# EAGLE schematic PinBed (EAGLE 6.5.0)
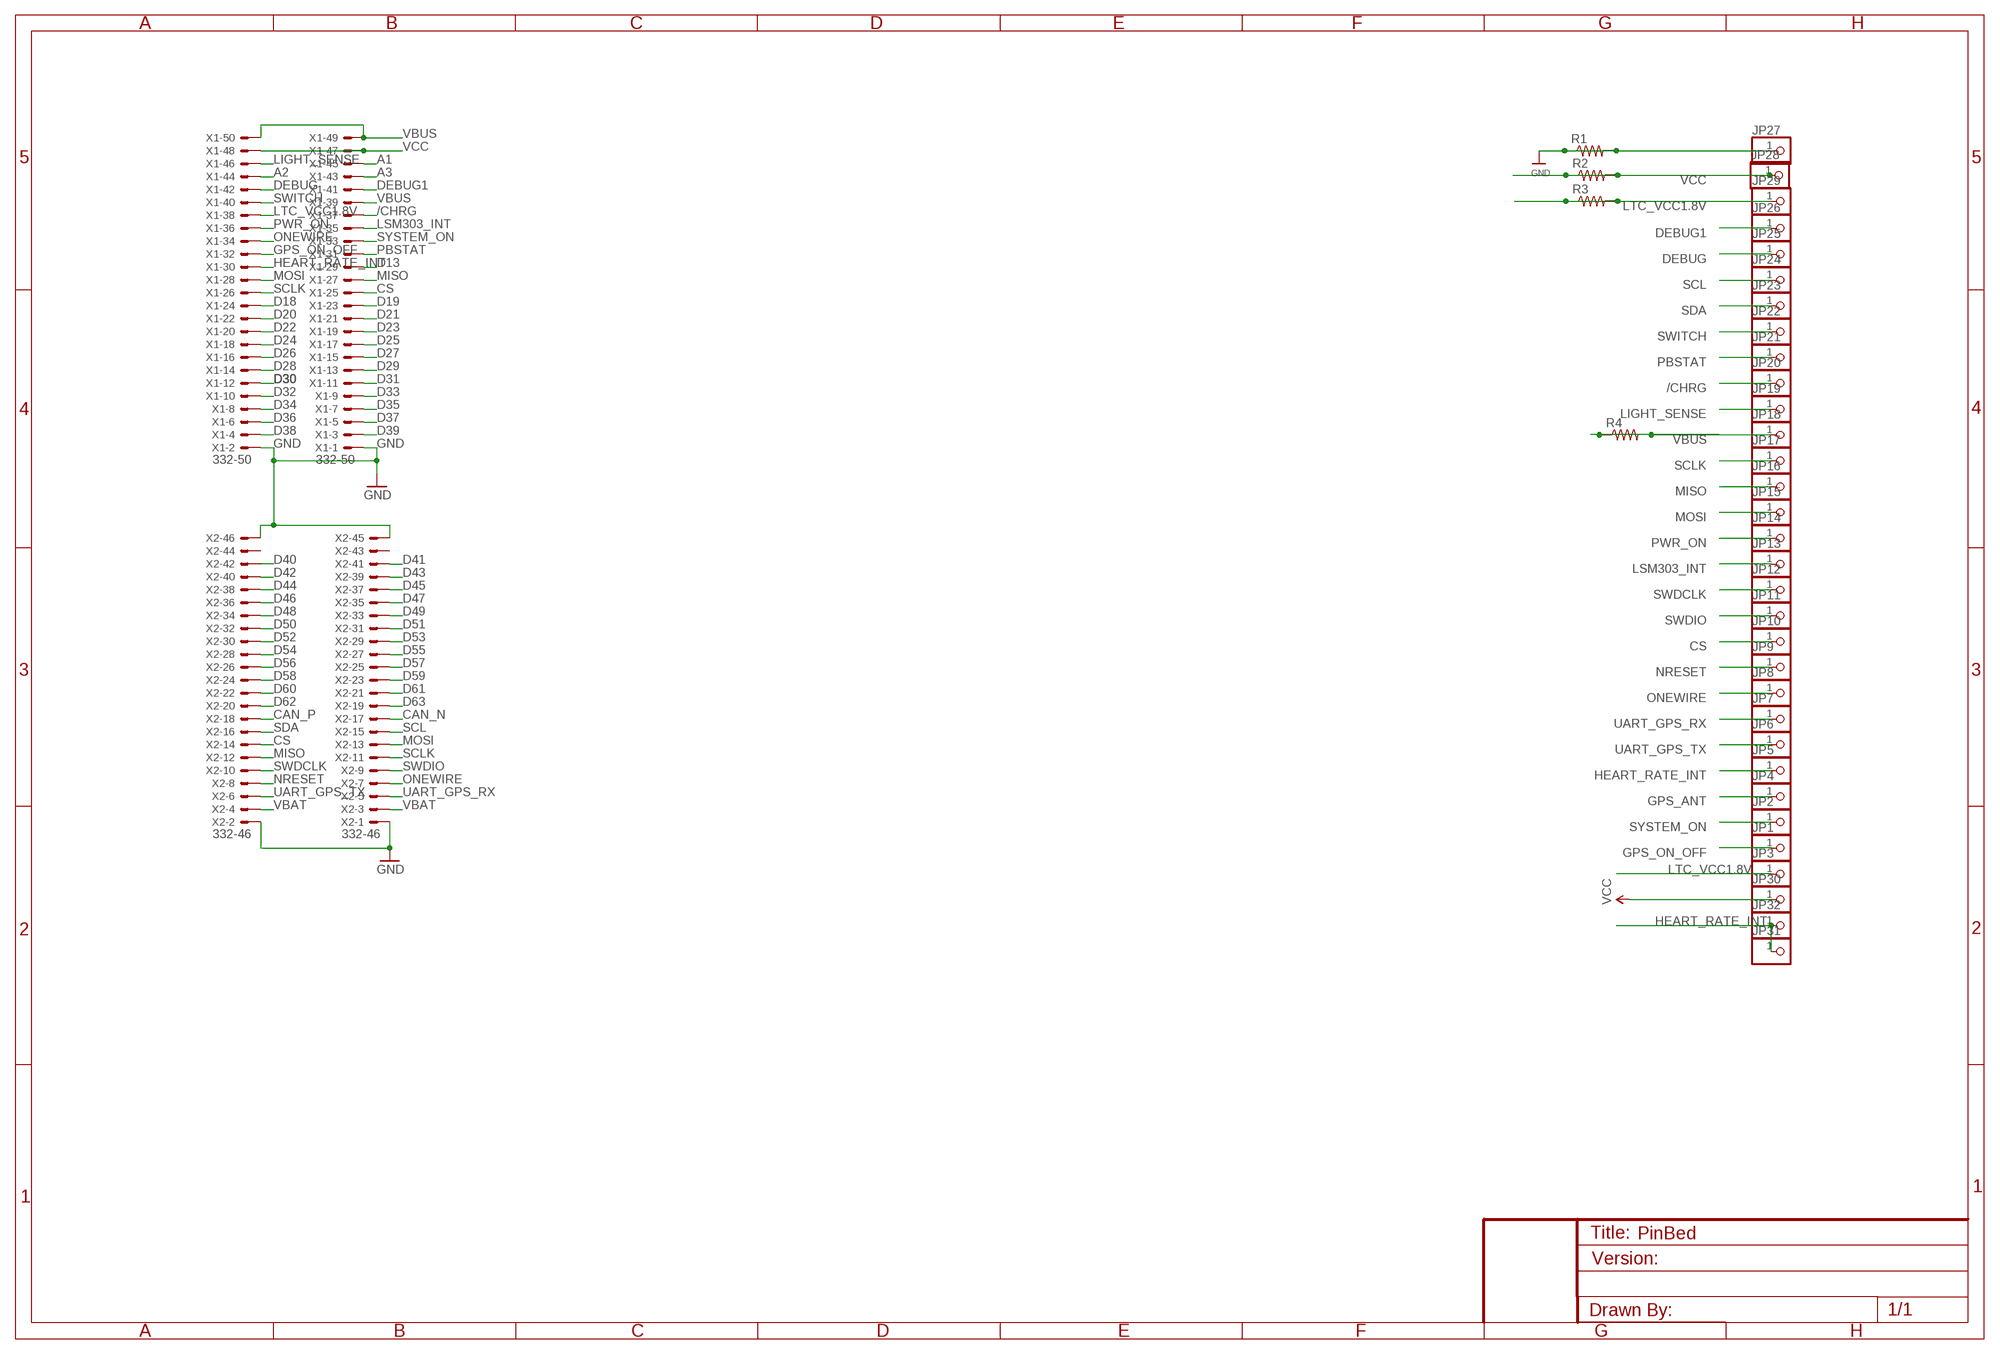
[diagram p0: schematic, sheet 1]

## Parts
JP1  PINHD-1X1CB  [1X01-CLEANBIG]
JP2  PINHD-1X1CB  [1X01-CLEANBIG]
JP3  PINHD-1X1CB  [1X01-CLEANBIG]
JP4  PINHD-1X1CB  [1X01-CLEANBIG]
JP5  PINHD-1X1CB  [1X01-CLEANBIG]
JP6  PINHD-1X1CB  [1X01-CLEANBIG]
JP7  PINHD-1X1CB  [1X01-CLEANBIG]
JP8  PINHD-1X1CB  [1X01-CLEANBIG]
JP9  PINHD-1X1CB  [1X01-CLEANBIG]
JP10  PINHD-1X1CB  [1X01-CLEANBIG]
JP11  PINHD-1X1CB  [1X01-CLEANBIG]
JP12  PINHD-1X1CB  [1X01-CLEANBIG]
JP13  PINHD-1X1CB  [1X01-CLEANBIG]
JP14  PINHD-1X1CB  [1X01-CLEANBIG]
JP15  PINHD-1X1CB  [1X01-CLEANBIG]
JP16  PINHD-1X1CB  [1X01-CLEANBIG]
JP17  PINHD-1X1CB  [1X01-CLEANBIG]
JP18  PINHD-1X1CB  [1X01-CLEANBIG]
JP19  PINHD-1X1CB  [1X01-CLEANBIG]
JP20  PINHD-1X1CB  [1X01-CLEANBIG]
JP21  PINHD-1X1CB  [1X01-CLEANBIG]
JP22  PINHD-1X1CB  [1X01-CLEANBIG]
JP23  PINHD-1X1CB  [1X01-CLEANBIG]
JP24  PINHD-1X1CB  [1X01-CLEANBIG]
JP25  PINHD-1X1CB  [1X01-CLEANBIG]
JP26  PINHD-1X1CB  [1X01-CLEANBIG]
JP27  PINHD-1X1CB  [1X01-CLEANBIG]
JP28  PINHD-1X1CB  [1X01-CLEANBIG]
JP29  PINHD-1X1CB  [1X01-CLEANBIG]
JP30  PINHD-1X1CB  [1X01-CLEANBIG]
JP31  PINHD-1X1CB  [1X01-CLEANBIG]
JP32  PINHD-1X1CB  [1X01-CLEANBIG]
R1  RESISTOR0805-RES  [0805]
R2  RESISTOR0805-RES  [0805]
R3  RESISTOR0805-RES  [0805]
R4  RESISTOR0805-RES  [0805]
X1  332-50  [332-50]
X2  332-46  [332-46]

## Nets
/CHRG: JP20.1 X1.37
A1: X1.45
A2: X1.44
A3: X1.43
CAN_N: X2.17
CAN_P: X2.18
CS: JP10.1 X1.25 X2.14
D13: X1.29
D18: X1.24
D19: X1.23
D20: X1.22
D21: X1.21
D22: X1.20
D23: X1.19
D24: X1.18
D25: X1.17
D26: X1.16
D27: X1.15
D28: X1.14
D29: X1.13
D30: X1.12
D31: X1.11
D32: X1.10
D33: X1.9
D34: X1.8
D35: X1.7
D36: X1.6
D37: X1.5
D38: X1.4
D39: X1.3
D40: X2.42
D41: X2.41
D42: X2.40
D43: X2.39
D44: X2.38
D45: X2.37
D46: X2.36
D47: X2.35
D48: X2.34
D49: X2.33
D50: X2.32
D51: X2.31
D52: X2.30
D53: X2.29
D54: X2.28
D55: X2.27
D56: X2.26
D57: X2.25
D58: X2.24
D59: X2.23
D60: X2.22
D61: X2.21
D62: X2.20
D63: X2.19
DEBUG: JP25.1 X1.42
DEBUG1: JP26.1 X1.41
GND [Power]: JP27.1 R1.1 R1.2 X1.1 X1.2 X2.1 X2.2 X2.45 X2.46
GPS_ANT: JP4.1
GPS_ON_OFF: JP1.1 X1.32
HEART_RATE_INT: JP5.1 JP31.1 JP32.1 X1.30
LIGHT_SENSE: JP19.1 X1.46
LSM303_INT: JP13.1 X1.35
LTC_VCC1.8V [Power]: JP3.1 JP29.1 R3.1 R3.2 X1.38
MISO: JP16.1 X1.27 X2.12
MOSI: JP15.1 X1.28 X2.13
NRESET: JP9.1 X2.8
ONEWIRE: JP8.1 X1.34 X2.7
PBSTAT: JP21.1 X1.31
PWR_ON: JP14.1 X1.36
SCL: JP24.1 X2.15
SCLK: JP17.1 X1.26 X2.11
SDA: JP23.1 X2.16
SWDCLK: JP12.1 X2.10
SWDIO: JP11.1 X2.9
SWITCH: JP22.1 X1.40
SYSTEM_ON: JP2.1 X1.33
UART_GPS_RX: JP7.1 X2.5
UART_GPS_TX: JP6.1 X2.6
VBAT: X2.3 X2.4
VBUS [Power]: JP18.1 R4.1 R4.2 X1.39 X1.49 X1.50
VCC [Power]: JP28.1 JP30.1 R2.1 R2.2 X1.47 X1.48
Unconnected: X2.43 X2.44

## Library data of the parts
JP1-JP32 = JDT-1800_smahed:PINHD-1X1: Pin header 1x1 for 0.1" spacing With round pins
R1-R4 = SparkFun-Passives:RESISTOR: Resistor Basic schematic elements and footprints for 0603, 1206, and PTH resistors.
X1 = con-garry:332-50: 50 Pin - 2mm Dual Row Source: www.mpe-connector.de / garry_shortform_2012.pdf
X2 = con-garry:332-46: 46 Pin - 2mm Dual Row Source: www.mpe-connector.de / garry_shortform_2012.pdf

## Net classes
0 default: clearance 0.152 mm
1 Power: width 0.508 mm